# Altium schematic sheet zara.SchDoc
size A4
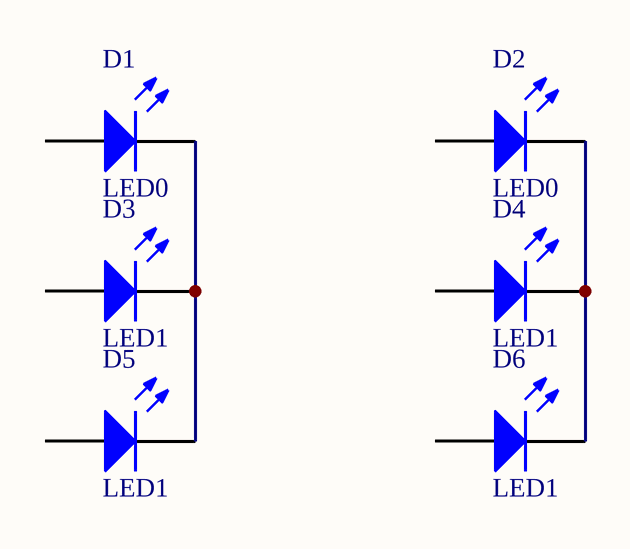
[diagram p0: zara.SchDoc]

## Parts
D1  LED0  [LED-0]
D2  LED0  [LED-0]
D3  LED1  [LED-1]
D4  LED1  [LED-1]
D5  LED1  [LED-1]
D6  LED1  [LED-1]

## Nets
NetD1_2: D1.2(K) D3.2(K) D5.2(K)
NetD2_2: D2.2(K) D4.2(K) D6.2(K)

Not connected (* = marked no-connect by the designer): D1 1(A); D2 1(A); D3 1(A); D4 1(A); D5 1(A); D6 1(A)

## Library data of the parts
D1 D2 = LED0: Typical INFRARED GaAs LED; Published: 8-Jun-2000; LatestRevisionDate: 08-Jul-2005; LatestRevisionNote: Mech Layer 1 removed.; PackageReference: LED-0; Publisher: Altium Limited; PackageDescription: LED; 2 Leads
D3-D6 = LED1: Typical RED GaAs LED; Published: 8-Jun-2000; LatestRevisionDate: 08-Jul-2005; LatestRevisionNote: Mech Layer 1 removed.; PackageReference: LED-1; Publisher: Altium Limited; PackageDescription: LED; 2 Leads